# EAGLE schematic .STM32LoRa (EAGLE 9.6.2)

## Sheet 1 of 3
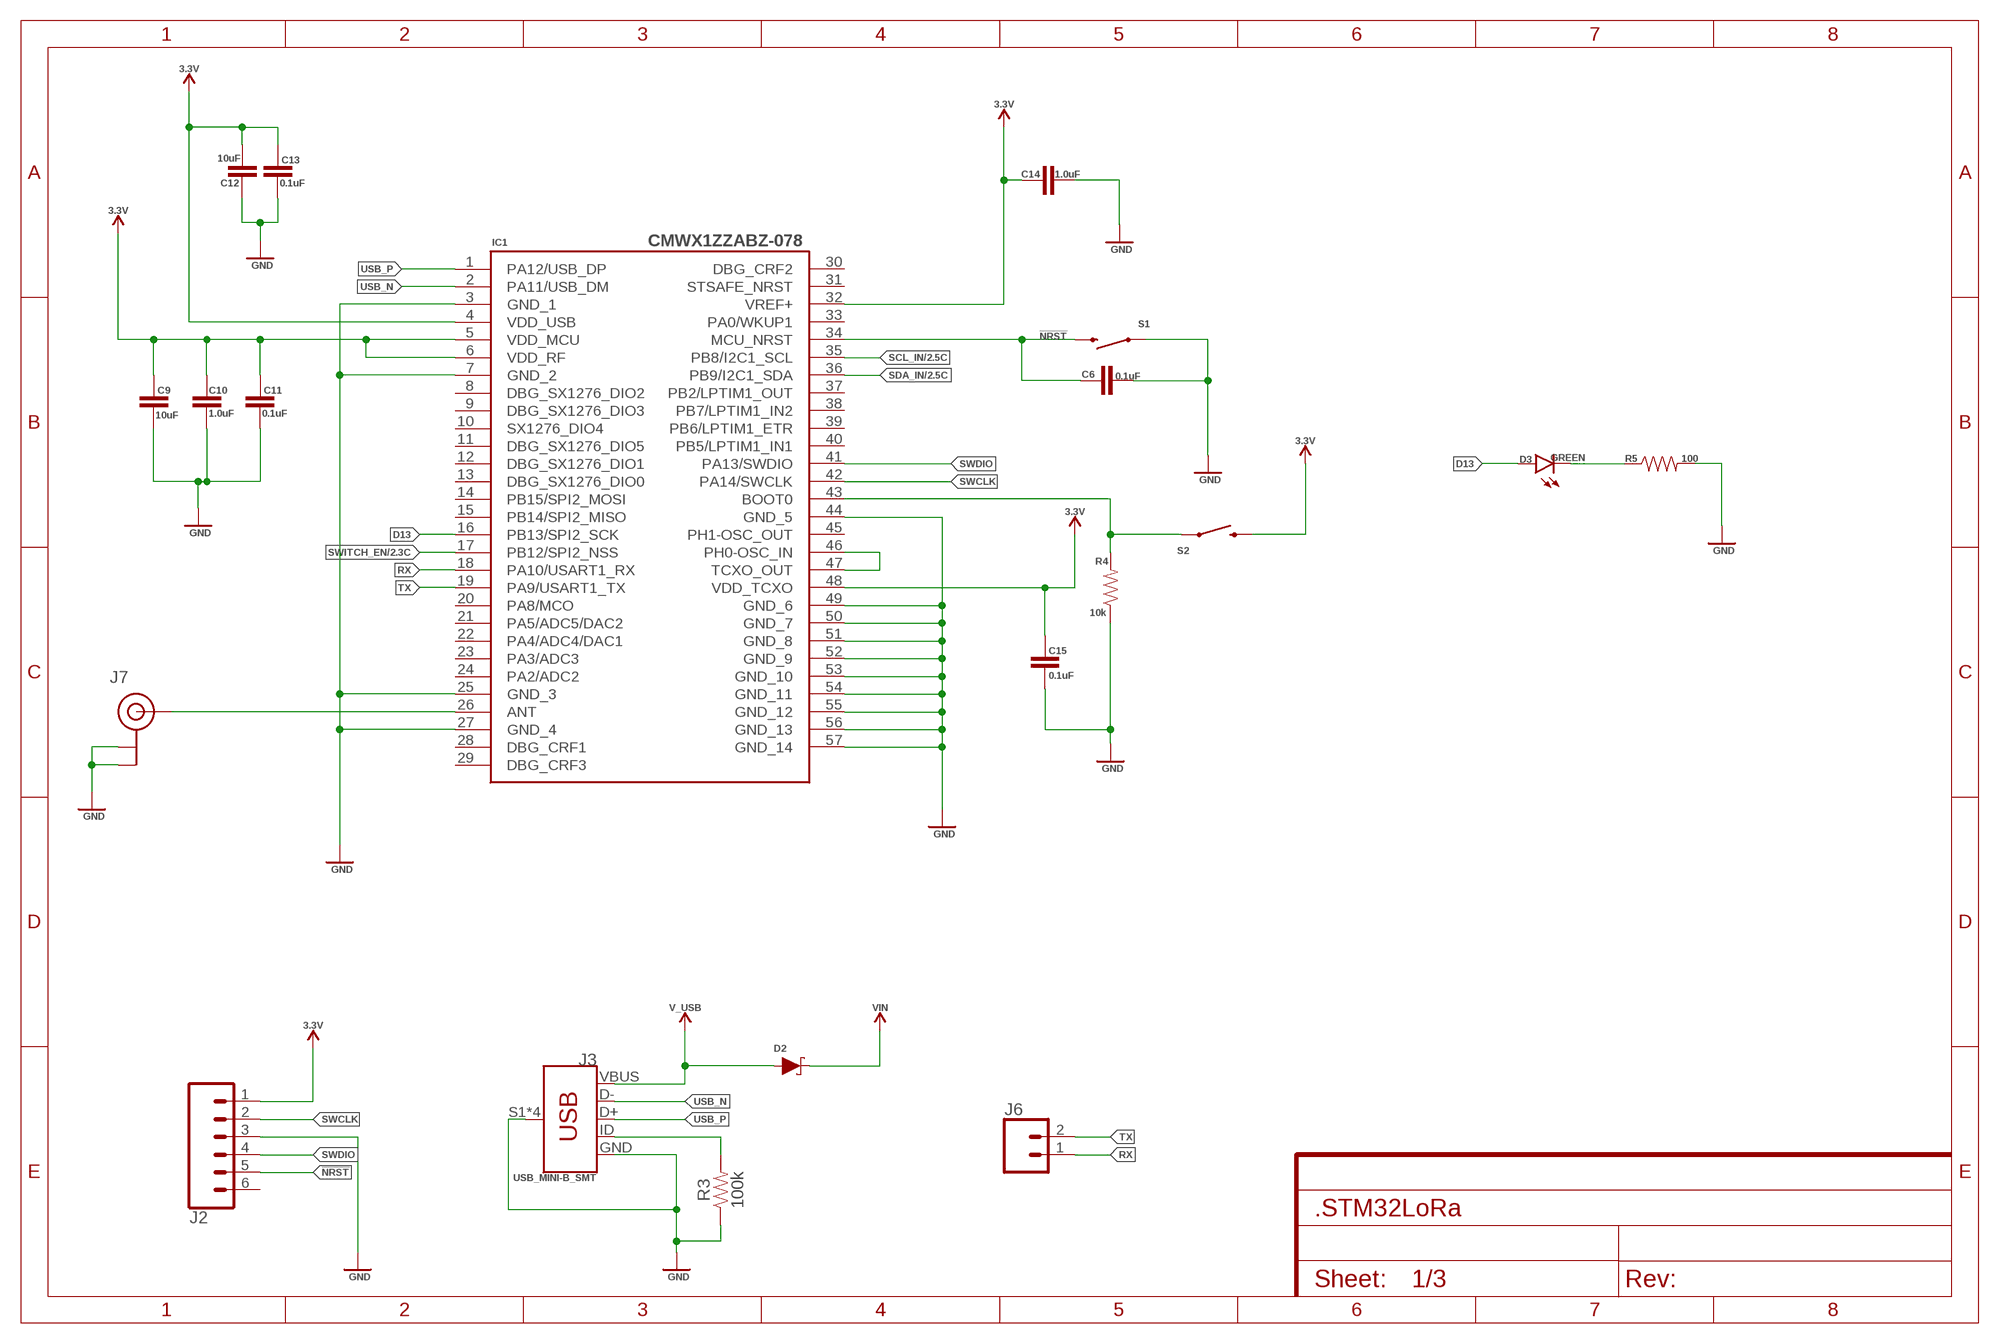
[diagram p0: schematic, sheet 1]

### Parts
C6  0.1uF  0.1UF-0603-25V-(+80/-20%)  [0603]
C9  10uF  10UF-0603-6.3V-20%  [0603]
C10  1.0uF  1.0UF-0603-16V-10%  [0603]
C11  0.1uF  0.1UF-0603-25V-(+80/-20%)  [0603]
C12  10uF  10UF-0603-6.3V-20%  [0603]
C13  0.1uF  0.1UF-0603-25V-(+80/-20%)  [0603]
C14  1.0uF  1.0UF-0603-16V-10%  [0603]
C15  0.1uF  0.1UF-0603-25V-(+80/-20%)  [0603]
D2  120mA/40V/370mV  DIODE-SCHOTTKY-RB751S40  [SOD-523]
D3  GREEN  LED-GREEN0603  [LED-0603]
IC1  CMWX1ZZABZ-078  [CMWX1ZZABZ-078]
J2  CONN_06LONGPADS  [1X06_LONGPADS]
J3  USB_MINI-B_SMT  [USB-MINIB]
J6  CONN_02  [1X02]
J7  U.FL  [U.FL]
R3  100k  100KOHM-0603-1/10W-1%  [0603]
R4  10k  10KOHM-0603-1/10W-1%  [0603]
R5  100  100OHM-0603-1/4W-5%  [0603]
S1  MOMENTARY-SWITCH-SPST-SMD-4.6X2.8MM  [TACTILE_SWITCH_SMD_4.6X2.8MM]
S2  MOMENTARY-SWITCH-SPST-SMD-4.6X2.8MM  [TACTILE_SWITCH_SMD_4.6X2.8MM]

### Nets
3.3V: C9.1 C10.1 C11.1 C12.2 C13.1 C14.1 C15.2 IC1.4(VDD_USB) IC1.5(VDD_MCU) IC1.6(VDD_RF) IC1.32(VREF+) IC1.48(VDD_TCXO) J2.1 S2.3 S2.4 ; also sheet 2,3
!NRST: C6.1 IC1.34(MCU_NRST) J2.5 S1.3 S1.4
D13: D3.A IC1.16(PB13/SPI2_SCK)
GND: C6.2 C9.2 C10.2 C11.2 C12.1 C13.2 C14.2 C15.1 IC1.3(GND_1) IC1.7(GND_2) IC1.25(GND_3) IC1.27(GND_4) IC1.44(GND_5) IC1.49(GND_6) IC1.50(GND_7) IC1.51(GND_8) IC1.52(GND_9) IC1.53(GND_10) IC1.54(GND_11) IC1.55(GND_12) IC1.56(GND_13) IC1.57(GND_14) J2.3 J3.GND J3.S1(SHIELD) J3.S2(SHIELD) J3.S3(SHIELD) J3.S4(SHIELD) J7.1(GND) J7.2(GND) R3.1 R4.1 R5.2 S1.1 S1.2 ; also sheet 2,3
N$7: J3.ID R3.2
N$8: IC1.43(BOOT0) R4.2 S2.1 S2.2
N$9: IC1.46(PH0-OSC_IN) IC1.47(TCXO_OUT)
N$10: IC1.26(ANT) J7.FEED(SIGNAL)
N$11: D3.C R5.1
RX: IC1.18(PA10/USART1_RX) J6.1
SCL_IN: IC1.35(PB8/I2C1_SCL) ; also sheet 2
SDA_IN: IC1.36(PB9/I2C1_SDA) ; also sheet 2
SWCLK: IC1.42(PA14/SWCLK) J2.2
SWDIO: IC1.41(PA13/SWDIO) J2.4
SWITCH_EN: IC1.17(PB12/SPI2_NSS) ; also sheet 2
TX: IC1.19(PA9/USART1_TX) J6.2
USB_N: IC1.2(PA11/USB_DM) J3.D-
USB_P: IC1.1(PA12/USB_DP) J3.D+
V_USB: D2.A J3.VBUS
VIN: D2.C ; also sheet 3
Unconnected: IC1.8(DBG_SX1276_DIO2) IC1.9(DBG_SX1276_DIO3) IC1.10(SX1276_DIO4) IC1.11(DBG_SX1276_DIO5) IC1.12(DBG_SX1276_DIO1) IC1.13(DBG_SX1276_DIO0) IC1.14(PB15/SPI2_MOSI) IC1.15(PB14/SPI2_MISO) IC1.20(PA8/MCO) IC1.21(PA5/ADC5/DAC2) IC1.22(PA4/ADC4/DAC1) IC1.23(PA3/ADC3) IC1.24(PA2/ADC2) IC1.28(DBG_CRF1) IC1.29(DBG_CRF3) IC1.30(DBG_CRF2) IC1.31(STSAFE_NRST) IC1.33(PA0/WKUP1) IC1.37(PB2/LPTIM1_OUT) IC1.38(PB7/LPTIM1_IN2) IC1.39(PB6/LPTIM1_ETR) IC1.40(PB5/LPTIM1_IN1) IC1.45(PH1-OSC_OUT) J2.6

## Sheet 2 of 3
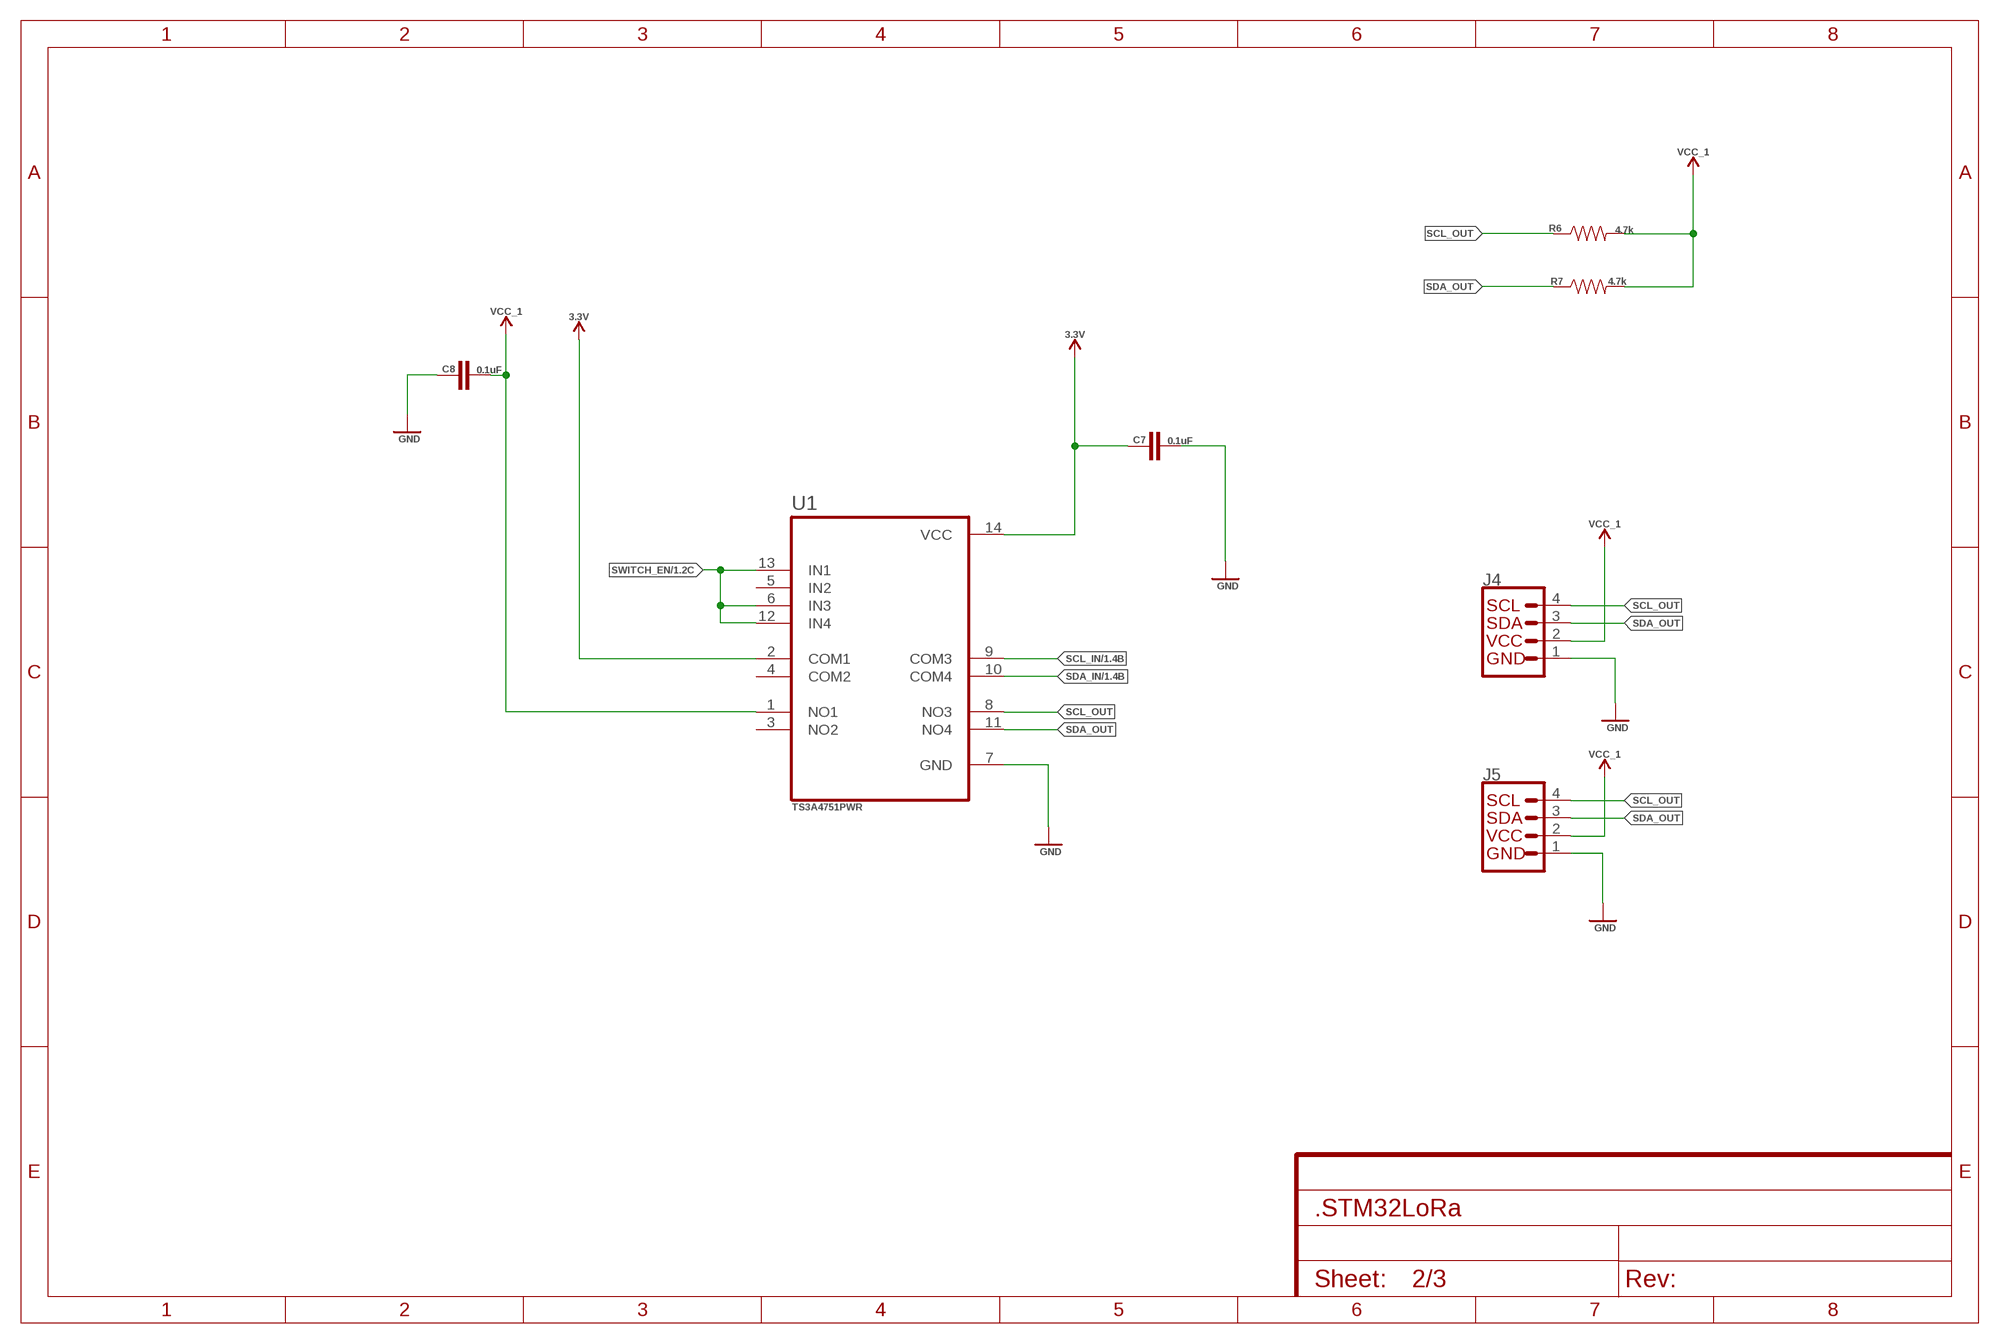
[diagram p1: schematic, sheet 2]

### Parts
C7  0.1uF  0.1UF-0603-25V-(+80/-20%)  [0603]
C8  0.1uF  0.1UF-0603-25V-(+80/-20%)  [0603]
J4  Qwiic Right Angle  I2C_STANDARDQWIIC  [1X04_1MM_RA]
J5  I2C_STANDARD  [1X04]
R6  4.7k  4.7KOHM-0603-1/10W-1%  [0603]
R7  4.7k  4.7KOHM-0603-1/10W-1%  [0603]
U1  TS3A4751PWR  [SOP65P640X120-14N]

### Nets
3.3V: C7.1 U1.2(COM1) U1.14(VCC) ; also sheet 1,3
GND: C7.2 C8.1 J4.1 J5.1 U1.7(GND) ; also sheet 1,3
SCL_IN: U1.9(COM3) ; also sheet 1
SCL_OUT: J4.4 J5.4 R6.1 U1.8(NO3)
SDA_IN: U1.10(COM4) ; also sheet 1
SDA_OUT: J4.3 J5.3 R7.1 U1.11(NO4)
SWITCH_EN: U1.6(IN3) U1.12(IN4) U1.13(IN1) ; also sheet 1
VCC_1: C8.2 J4.2 J5.2 R6.2 R7.2 U1.1(NO1)
Unconnected: U1.3(NO2) U1.4(COM2) U1.5(IN2)

## Sheet 3 of 3
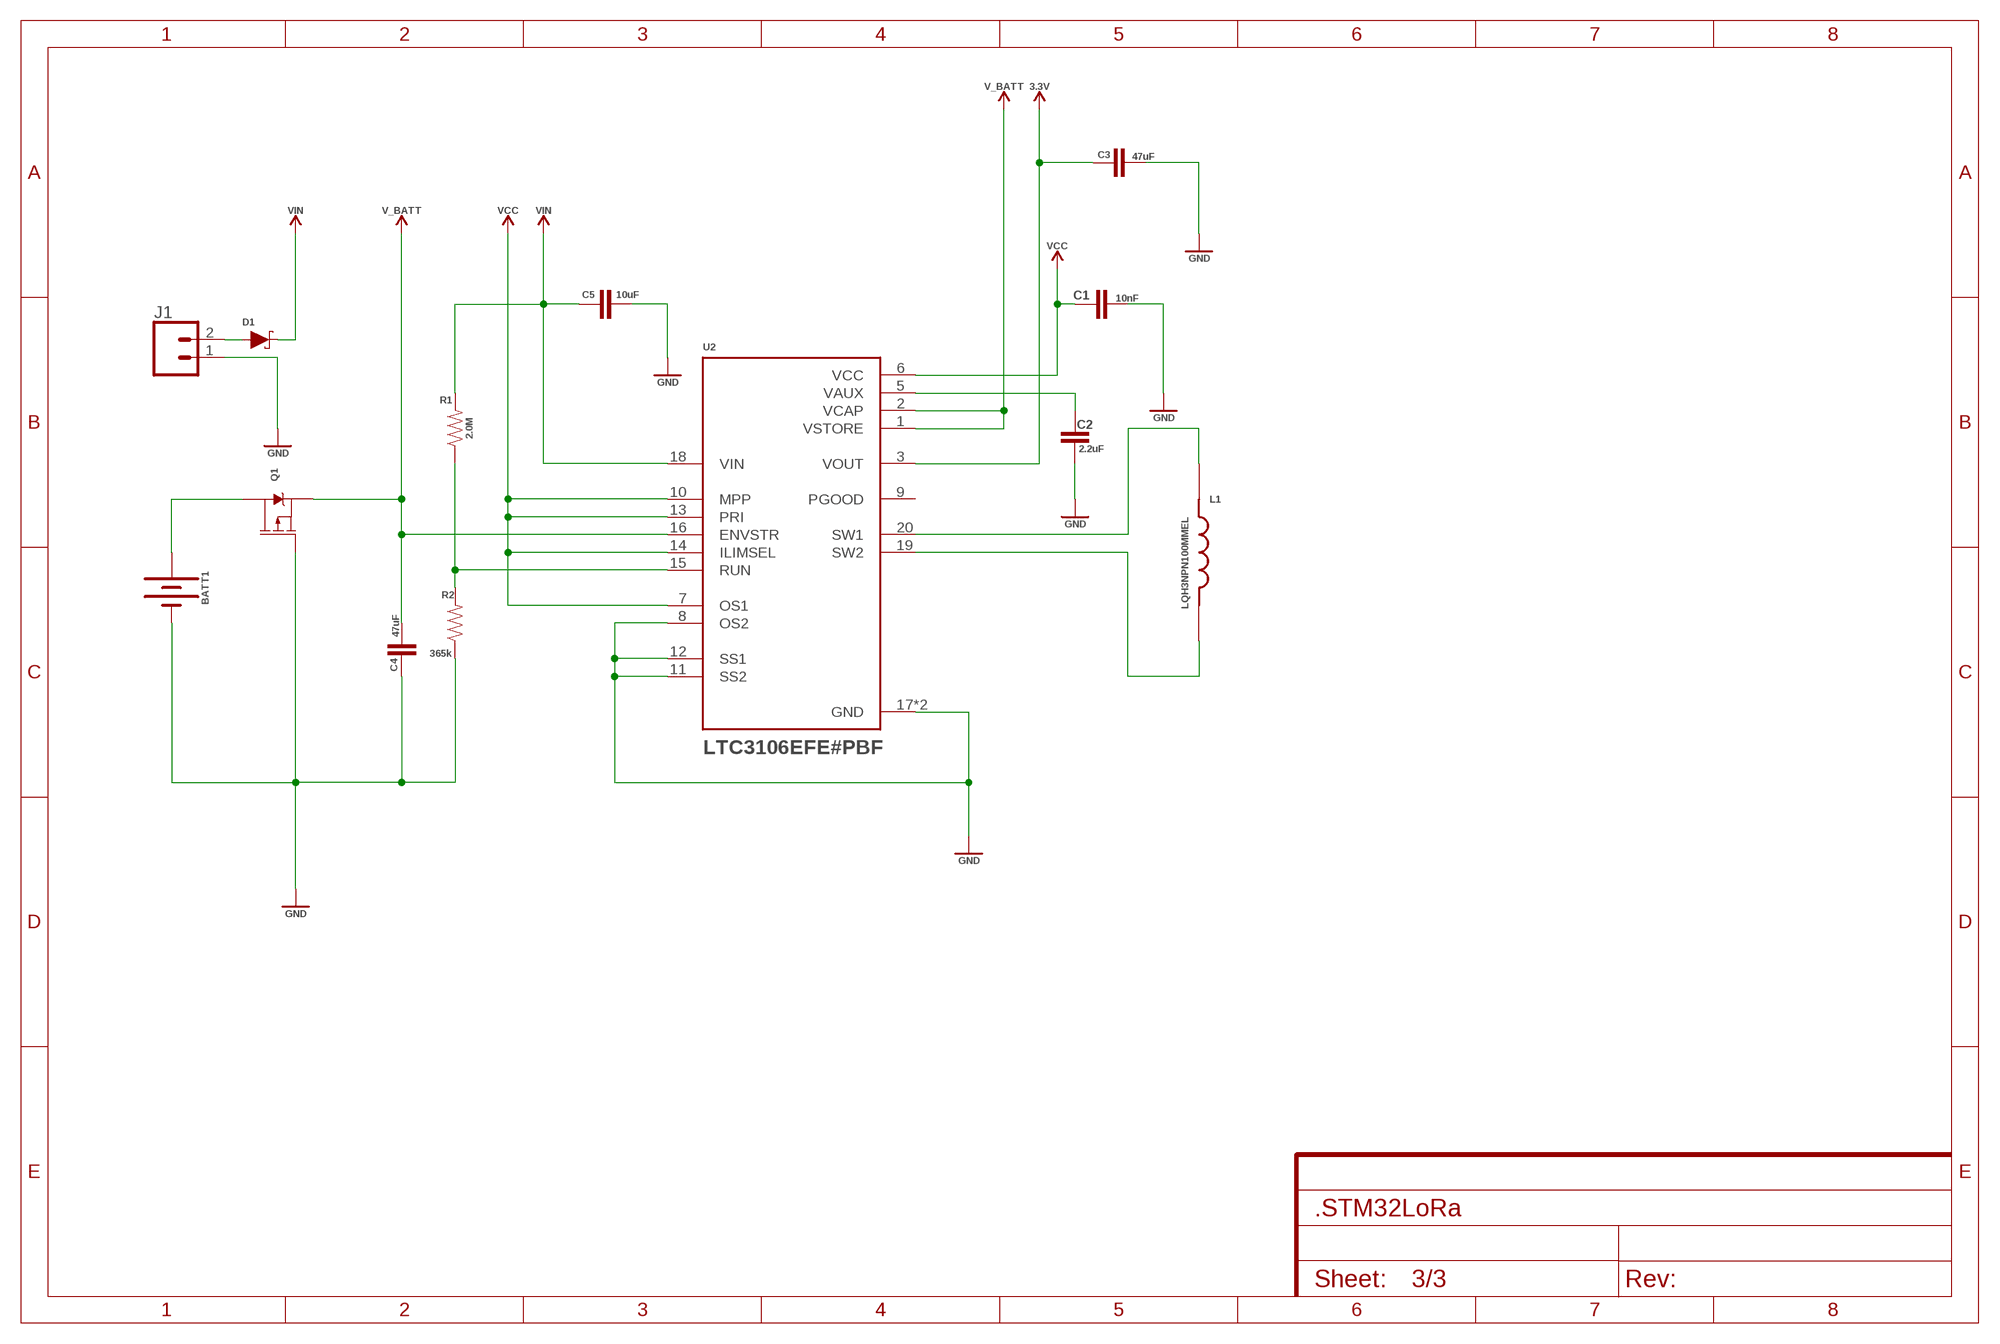
[diagram p2: schematic, sheet 3]

### Parts
BATT1  KEYSTONE_54KEYSTONE_2  [KEYSTONE_V2]
C1  10nF  10NF-0603-50V-10%  [0603]
C2  2.2uF  2.2UF-0603-10V-20%  [0603]
C3  47uF  4.7UF0603  [0603]
C4  47uF  4.7UF0603  [0603]
C5  10uF  10UF-0603-6.3V-20%  [0603]
D1  120mA/40V/370mV  DIODE-SCHOTTKY-RB751S40  [SOD-523]
J1  CONN_023.5MM  [SCREWTERMINAL-3.5MM-2]
L1  LQH3NPN100MMEL  [IND_LQH3NPN100MMEL]
Q1  2.5A/30V/105mΩ  MOSFET_PCH-DMG2307L  [SOT23-3]
R1  2.0M  2MOHMS-0603-1/10W-1%  [0603]
R2  365k  390KOHM-0603-1/10W-1%  [0603]
U2  LTC3106EFE#PBF  [SOP65P640X120-21N]

### Nets
3.3V: C3.1 U2.3(VOUT) ; also sheet 1,2
GND: BATT1.P$4(-) BATT1.P$5(-) BATT1.P$6(-) C1.2 C2.2 C3.2 C4.1 C5.2 J1.1 Q1.1(G) R2.1 U2.8(OS2) U2.11(SS2) U2.12(SS1) U2.17(GND) U2.21(GND) ; also sheet 1,2
N$1: L1.1 U2.20(SW1)
N$2: L1.2 U2.19(SW2)
N$3: C2.1 U2.5(VAUX)
N$4: BATT1.P$1(+) BATT1.P$2(+) BATT1.P$3(+) Q1.3(D)
N$5: R1.1 R2.2 U2.15(RUN)
N$6: D1.A J1.2
V_BATT: C4.2 Q1.2(S) U2.1(VSTORE) U2.2(VCAP) U2.16(ENVSTR)
VCC: C1.1 U2.6(VCC) U2.7(OS1) U2.10(MPP) U2.13(PRI) U2.14(ILIMSEL)
VIN: C5.1 D1.C R1.2 U2.18(VIN) ; also sheet 1
Unconnected: U2.9(PGOOD)

## Library data of the parts
BATT1 = battery_54:KEYSTONE_54
C1 = SparkFun-Capacitors:10NF: 0.01uF/10nF/10,000pF ceramic capacitors A capacitor is a passive two-terminal electrical component used to store electrical energy temporarily in an electric field. CAP-09321; PROD_ID: CAP-00867
C2 = SparkFun-Capacitors:2.2UF: 2.2µF ceramic capacitors A capacitor is a passive two-terminal electrical component used to store electrical energy temporarily in an electric field.; PROD_ID: CAP-07888
C3 C4 = SparkFun-Capacitors:4.7UF: 4.7µF ceramic capacitors A capacitor is a passive two-terminal electrical component used to store electrical energy temporarily in an electric field.; PROD_ID: CAP-08280; VALUE: 4.7uF
C5 C9 C12 = SparkFun-Capacitors:10UF: 10.0µF ceramic capacitors A capacitor is a passive two-terminal electrical component used to store electrical energy temporarily in an electric field.; PROD_ID: CAP-11015
C6-C8 C11 C13 C15 = SparkFun-Capacitors:0.1UF: 0.1µF ceramic capacitors A capacitor is a passive two-terminal electrical component used to store electrical energy temporarily in an electric field.; PROD_ID: CAP-00810
C10 C14 = SparkFun-Capacitors:1.0UF: 1µF ceramic capacitors A capacitor is a passive two-terminal electrical component used to store electrical energy temporarily in an electric field.; PROD_ID: CAP-00868
D1 D2 = SparkFun-DiscreteSemi:DIODE-SCHOTTKY: Schottky diode A Schottky diode is a semiconductor diode which has a low forward voltage drop and a very fast switching action.; PROD_ID: DIO-11018
D3 = SparkFun-LED:LED-GREEN: Green SMD LED Used in manufacturing of various products at SparkFun Packages: 0603 - SMD 0603 package [Product Link] <http://www.futureelectronics.com/en/technologies/semiconductors/optoelectronics/leds/Pages/9894312-LTST-C190GKT.aspx?CrossPart=HSMG-C190&IM=0> LilyPad 1206 - SMD1206 LilyPad package [Product Link] <http://www.futureelectronics.com/en/Technologies/Product.aspx?ProductID=IN150NGHARVATEKCORPORATION2049943&IM=0> 1206 - SMD1206 package [Product Link] <http://www.futureelectronics.com/en/technologies/semiconductors/optoelectronics/leds/Pages/8315665-LTST-C150KGKT.aspx?IM=0> 1206 Bottom Mount -SMD 1206 Bottom Mount [Product Link] <http://www.digikey.com/product-detail/en/lite-on-inc/LTST-C230KGKT/160-1456-1-ND/386854> SparkFun Products: Pro Mini 328 -5V <https://www.sparkfun.com/products/821> RedBoard <https://www.sparkfun.com/products/12757> MP3 Trigger <https://www.sparkfun.com/products/13720> Makey Makey <https://www.sparkfun.com/products/11076>; PROD_ID: DIO-00821
IC1 = SamacSys_Parts:CMWX1ZZABZ-078: RF Modules Type ABZ LoRa Module MCU - STM32L082 Source: Datasheet; DESCRIPTION: RF Modules Type ABZ LoRa Module MCU - STM32L082; HEIGHT: mm; MANUFACTURER_NAME: Murata Electronics; MANUFACTURER_PART_NUMBER: CMWX1ZZABZ-078; MOUSER_PART_NUMBER: 81-CMWX1ZZABZ-078; MOUSER_PRICE-STOCK: https://www.mouser.co.uk/ProductDetail/Murata-Electronics/CMWX1ZZABZ-078?qs=POvGejmMzm8lN1bzM2%2FdRQ%3D%3D
J1 = SparkFun-Connectors:CONN_02: Multi connection point. Often used as Generic Header-pin footprint for 0.1 inch spaced/style header connections On any of the 0.1 inch spaced packages, you can populate with these: Break Away Headers - Straight <https://www.sparkfun.com/products/116> (PRT-00116) Break Away Male Headers - Right Angle <https://www.sparkfun.com/products/553> (PRT-00553) Female Headers <https://www.sparkfun.com/products/115> (PRT-00115) Break Away Headers - Machine Pin <https://www.sparkfun.com/products/117> (PRT-00117) Break Away Female Headers - Swiss Machine Pin <https://www.sparkfun.com/products/743> (PRT-00743) For SCREWTERMINALS and SPRING TERMINALS visit here: Screw Terimnals on SparkFun.com <https://www.sparkfun.com/search/results?term=Screw+Terminals> (5mm/3.5mm/2.54mm spacing) This device is also useful as a general connection point to wire up your design to another part of your project. Our various solder wires solder well into these plated through hole pads. Hook-Up Wire - Assortment (Stranded, 22 AWG) <https://www.sparkfun.com/products/11375> (PRT-11375) Hook-Up Wire - Assortment (Solid Core, 22 AWG) <https://www.sparkfun.com/products/11367> (PRT-11367) View the entire wire category on our website here <https://www.sparkfun.com/categories/141> Special notes: Molex polarized connector foot print use with: PRT-08233 with associated crimp pins and housings. 2.54_SCREWTERM for use with PRT-10571. 3.5mm Screw Terminal footprints for PRT-08084 5mm Screw Terminal footprints for use with PRT-08432; PROD_ID: CONN-08399
J2 = SparkFun-Connectors:CONN_06: Multi connection point. Often used as Generic Header-pin footprint for 0.1 inch spaced/style header connections On any of the 0.1 inch spaced packages, you can populate with these: Break Away Headers - Straight <https://www.sparkfun.com/products/116> (PRT-00116) Break Away Male Headers - Right Angle <https://www.sparkfun.com/products/553> (PRT-00553) Female Headers <https://www.sparkfun.com/products/115> (PRT-00115) Break Away Headers - Machine Pin <https://www.sparkfun.com/products/117> (PRT-00117) Break Away Female Headers - Swiss Machine Pin <https://www.sparkfun.com/products/743> (PRT-00743) Arduino Stackable Header - 6 Pin <https://www.sparkfun.com/products/9280> (PRT-09280) For SCREWTERMINALS and SPRING TERMINALS visit here: Screw Terimnals on SparkFun.com <https://www.sparkfun.com/search/results?term=Screw+Terminals> (5mm/3.5mm/2.54mm spacing) This device is also useful as a general connection point to wire up your design to another part of your project. Our various solder wires solder well into these plated through hole pads. Hook-Up Wire - Assortment (Stranded, 22 AWG) <https://www.sparkfun.com/products/11375> (PRT-11375) Hook-Up Wire - Assortment (Solid Core, 22 AWG) <https://www.sparkfun.com/products/11367> (PRT-11367) View the entire wire category on our website here <https://www.sparkfun.com/categories/141>
J3 = SparkFun-Connectors:USB_MINI-B: USB type Mini-B Connector Breaks out 5th pin, and includes shield pins if needed. SparkFun Products: SparkFun FTDI Basic Breakout <https://www.sparkfun.com/products/9716> SparkFun XBee Explorer USB <https://www.sparkfun.com/products/11812> SparkFun Redboard <https://www.sparkfun.com/products/12757>; PROD_ID: CONN-08193; SF_ID: PRT-00587
J4 = SparkFun-Connectors:I2C_STANDARD: SparkFun I2C Standard Pinout Header SparkFun has standardized on a pinout for all I2C based sensor breakouts. This pinout allows I2C boards to be plugged directly into the headers on Arduino Uno compatible boards, and to be daisy chained easily. Example SparkFun Products: SparkFun Atmospheric Sensor Breakout - BME280 <https://www.sparkfun.com/products/13676> SparkFun Altitude/Pressure Sensor Breakout - MPL3115A2 <https://www.sparkfun.com/products/11084> SparkFun TOF Range Finder Sensor - VL6180 <https://www.sparkfun.com/products/12785>; PROD_ID: CONN-13694
J5 = SparkFun-Connectors:I2C_STANDARD: SparkFun I2C Standard Pinout Header SparkFun has standardized on a pinout for all I2C based sensor breakouts. This pinout allows I2C boards to be plugged directly into the headers on Arduino Uno compatible boards, and to be daisy chained easily. Example SparkFun Products: SparkFun Atmospheric Sensor Breakout - BME280 <https://www.sparkfun.com/products/13676> SparkFun Altitude/Pressure Sensor Breakout - MPL3115A2 <https://www.sparkfun.com/products/11084> SparkFun TOF Range Finder Sensor - VL6180 <https://www.sparkfun.com/products/12785>
J6 = SparkFun-Connectors:CONN_02: Multi connection point. Often used as Generic Header-pin footprint for 0.1 inch spaced/style header connections On any of the 0.1 inch spaced packages, you can populate with these: Break Away Headers - Straight <https://www.sparkfun.com/products/116> (PRT-00116) Break Away Male Headers - Right Angle <https://www.sparkfun.com/products/553> (PRT-00553) Female Headers <https://www.sparkfun.com/products/115> (PRT-00115) Break Away Headers - Machine Pin <https://www.sparkfun.com/products/117> (PRT-00117) Break Away Female Headers - Swiss Machine Pin <https://www.sparkfun.com/products/743> (PRT-00743) For SCREWTERMINALS and SPRING TERMINALS visit here: Screw Terimnals on SparkFun.com <https://www.sparkfun.com/search/results?term=Screw+Terminals> (5mm/3.5mm/2.54mm spacing) This device is also useful as a general connection point to wire up your design to another part of your project. Our various solder wires solder well into these plated through hole pads. Hook-Up Wire - Assortment (Stranded, 22 AWG) <https://www.sparkfun.com/products/11375> (PRT-11375) Hook-Up Wire - Assortment (Solid Core, 22 AWG) <https://www.sparkfun.com/products/11367> (PRT-11367) View the entire wire category on our website here <https://www.sparkfun.com/categories/141> Special notes: Molex polarized connector foot print use with: PRT-08233 with associated crimp pins and housings. 2.54_SCREWTERM for use with PRT-10571. 3.5mm Screw Terminal footprints for PRT-08084 5mm Screw Terminal footprints for use with PRT-08432
J7 = SparkFun-Connectors:U.FL: SMD Antenna Connector - U.FL 2mm height, 3.0mm x 3.0mm receptacle size. SparkFun Products: SparkFun WiFi Shield - ESP8266 <https://www.sparkfun.com/products/13287> SparkFun ESP8266 Thing <https://www.sparkfun.com/products/13231> SparkFun MiniGen - Pro Mini Signal Generator Shield <https://www.sparkfun.com/products/11420>; PROD_ID: CONN-09193; SF_ID: WRL-09144
L1 = LQH3NPN100MMEL:LQH3NPN100MMEL: Fixed Inductors; DESCRIPTION: 10µH Shielded Wirewound Inductor 800mA 228mOhm Max 1212 (3030 Metric); DIGI-KEY_PART_NUMBER: 490-15945-1-ND; DIGIKEY-PURCHASE-URL: https://snapeda.com/shop?store=DigiKey&id=4547508; MF: Murata; MOUSER-PURCHASE-URL: https://snapeda.com/shop?store=Mouser&id=4547508; MP: LQH3NPN100MMEL; PACKAGE: 1212 Murata
Q1 = SparkFun-DiscreteSemi:MOSFET_PCH: P-channel MOSFETs Voltage controlled devices that allow control of high current outputs. SparkFun Products: SparkFun ESP32 Thing <https://www.sparkfun.com/products/13907> SparkFun ESP8266 Thing <https://www.sparkfun.com/products/13231>; PROD_ID: TRANS-11308
R1 = SparkFun-Resistors:2MOHMS: 2MΩ resistor A resistor is a passive two-terminal electrical component that implements electrical resistance as a circuit element. Resistors act to reduce current flow, and, at the same time, act to lower voltage levels within circuits. - Wikipedia; PROD_ID: RES-10054
R2 = SparkFun-Resistors:390KOHM: 390kΩ resistor A resistor is a passive two-terminal electrical component that implements electrical resistance as a circuit element. Resistors act to reduce current flow, and, at the same time, act to lower voltage levels within circuits. - Wikipedia; PROD_ID: RES-12024; VALUE: 390k
R3 = SparkFun-Resistors:100KOHM: 100kΩ resistor A resistor is a passive two-terminal electrical component that implements electrical resistance as a circuit element. Resistors act to reduce current flow, and, at the same time, act to lower voltage levels within circuits. - Wikipedia; PROD_ID: RES-07828
R4 = SparkFun-Resistors:10KOHM: 10kΩ resistor A resistor is a passive two-terminal electrical component that implements electrical resistance as a circuit element. Resistors act to reduce current flow, and, at the same time, act to lower voltage levels within circuits. - Wikipedia; PROD_ID: RES-00824
R5 = SparkFun-Resistors:100OHM: 100Ω resistor A resistor is a passive two-terminal electrical component that implements electrical resistance as a circuit element. Resistors act to reduce current flow, and, at the same time, act to lower voltage levels within circuits. - Wikipedia; PROD_ID: RES-12438
R6 R7 = SparkFun-Resistors:4.7KOHM: 4.7kΩ resistor A resistor is a passive two-terminal electrical component that implements electrical resistance as a circuit element. Resistors act to reduce current flow, and, at the same time, act to lower voltage levels within circuits. - Wikipedia; PROD_ID: RES-07857
S1 S2 = SparkFun-Switches:MOMENTARY-SWITCH-SPST: Momentary Switch (Pushbutton) - SPST Normally-open (NO) SPST momentary switches (buttons, pushbuttons). Variants PTH-12MM - 12mm square, through-hole Momentary Pushbutton Switch - 12mm Square <https://www.sparkfun.com/products/9190> (COM-09190) PTH-6.0MM, PTH-6.0MM-KIT - 6.0mm square, through-hole Mini Pushbutton Switch <https://www.sparkfun.com/products/97> (COM-00097) KIT package intended for soldering kit's - only one side of pads' copper is exposed. PTH-RIGHT-ANGLE-KIT - Right-angle, through-hole Right Angle Tactile Button <https://www.sparkfun.com/products/10791> - Used on SparkFun BigTime Watch Kit <https://www.sparkfun.com/products/11734> SMD-12MM - 12mm square, surface-mount Tactile Button - SMD (12mm) <https://www.sparkfun.com/products/12993> (COM-12993) Used on SparkFun PicoBoard <https://www.sparkfun.com/products/11888> SMD-4.5MM - 4.5mm Square Trackball Switch Used on SparkFun Blackberry Trackballer Breakout <https://www.sparkfun.com/products/13169> SMD-4.6MMX2.8MM - 4.60mm x 2.80mm, surface mount Used on SparkFun SAMD21 Mini Breakout <https://www.sparkfun.com/products/13664> SMD-5.2MM, SMD-5.2-REDUNDANT - 5.2mm square, surface-mount Mini Pushbutton Switch - SMD <https://www.sparkfun.com/products/8720> (COM-08720) Used on Arduino Pro Mini <https://www.sparkfun.com/products/11114> REDUNDANT package connects both switch circuits together SMD-6.0X3.5MM - 6.0 x 3.5mm, surface mount Momentary Reset Switch SMD <https://www.sparkfun.com/products/8229> (COM-08229) SMD-6.2MM-TALL - 6.2mm square, surface mount Tactile Button - SMD (6mm) <https://www.sparkfun.com/products/12992> Used on SparkFun Digital Sandbox <https://www.sparkfun.com/products/12651> SMD-RIGHT-ANGLE - Right-angle, surface mount Used on SparkFun Block for Intel® Edison - Arduino <https://www.sparkfun.com/products/13036>; PROD_ID: SWCH-13065
U1 = TS3A4751PWR:TS3A4751PWR; ARROW_ELECTRONICS-PURCHASE-URL: https://snapeda.com/shop?store=Arrow+Electronics&id=361966; DESCRIPTION: 0.9-?, 3.3-V, 1:1 (SPST), 4-channel analog switch with 1.8-V input logic 14-TSSOP -40 to 85; DIGI-KEY_PART_NUMBER: 296-20700-1-ND; DIGIKEY-PURCHASE-URL: https://snapeda.com/shop?store=DigiKey&id=361966; MF: Texas Instruments; MOUSER-PURCHASE-URL: https://snapeda.com/shop?store=Mouser&id=361966; MP: TS3A4751PWR; PACKAGE: TSSOP-14 Texas Instruments; TEXAS_INSTRUMENTS-PURCHASE-URL: https://snapeda.com/shop?store=Texas+Instruments&id=361966
U2 = LTC3106EFE_PBF:LTC3106EFE#PBF: LTC3106 - 300mA Low Voltage Buck-Boost Converter with PowerPath and 1.6μA Quiescent Current; DESCRIPTION: Conv DC-DC -0.3V to 6V Non-Inv/Inv/Step Up/Step Down Single-Out 1.8V/2.2V/3.3V/5V 0.3A 20-Pin TSSOP; MF: Analog Devices; MOUSER-PURCHASE-URL: https://snapeda.com/shop?store=Mouser&id=4332360; MP: LTC3106EFE#PBF; PACKAGE: TSSOP W/ EP-20 Analog Devices